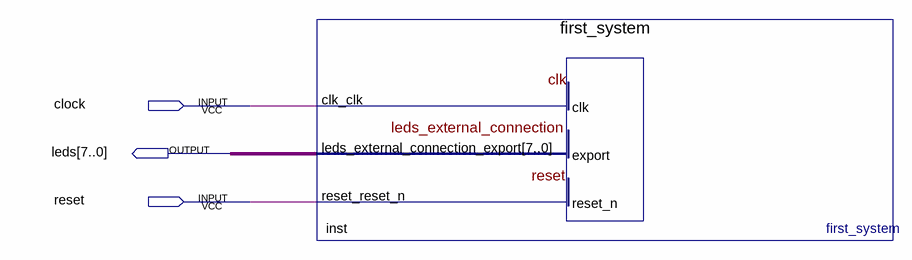
[diagram p0: schematic sheet]
// Quartus schematic practica_minios.bdf as structural Verilog: 1 symbols, 3 pins
module practica_minios (
  input  clock,
  input  reset,
  output [7:0] leds
);

  first_system inst (.clk_clk(clock), .reset_reset_n(reset), .leds_external_connection_export(leds));
endmodule
